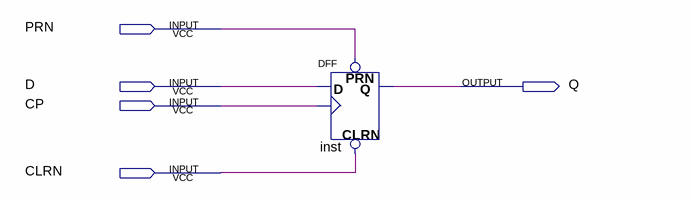
[diagram p0: schematic sheet]
// Quartus schematic D_trigger.bdf as structural Verilog: 1 symbols, 5 pins
module D_trigger (
  input  PRN,
  input  D,
  input  CP,
  input  CLRN,
  output Q
);

  DFF inst (.CLRN(CLRN), .CLK(CP), .D(D), .PRN(PRN), .Q(Q));
endmodule
